# Altium schematic sheet RF.SchDoc: Air724UG 参考设计
size 594 x 419 mm; DESIGNER: Loukanghua; REV: V1.0
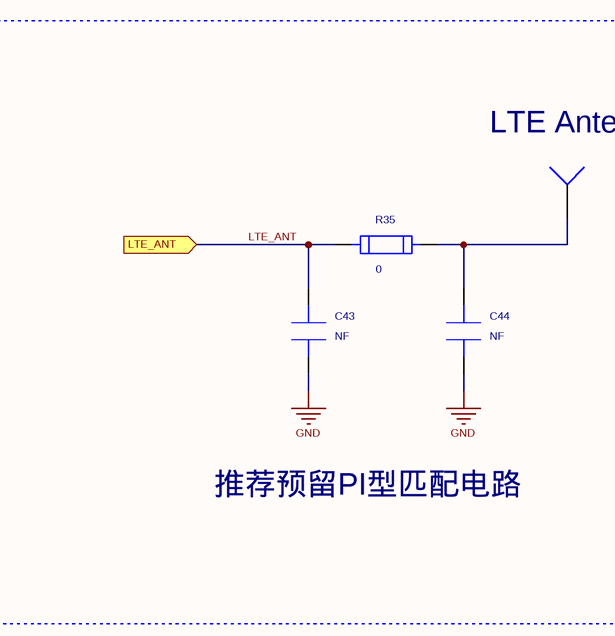
[diagram p0: RF.SchDoc, top left]
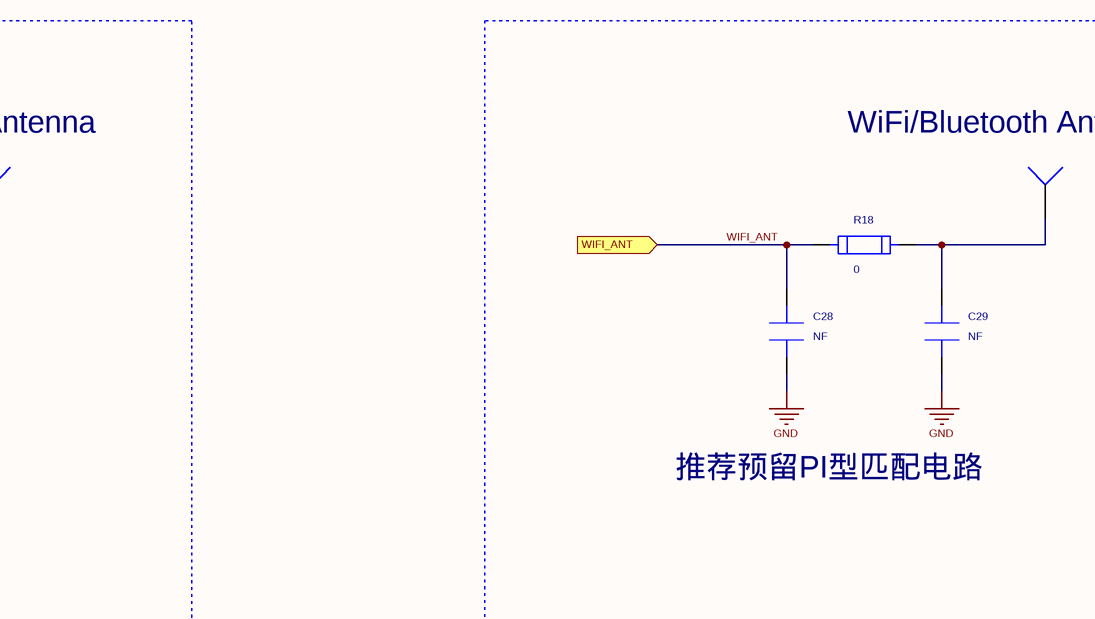
[diagram p1: RF.SchDoc, top middle]
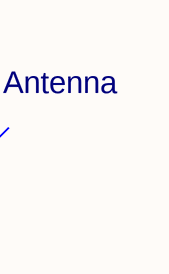
[diagram p2: RF.SchDoc, top right]
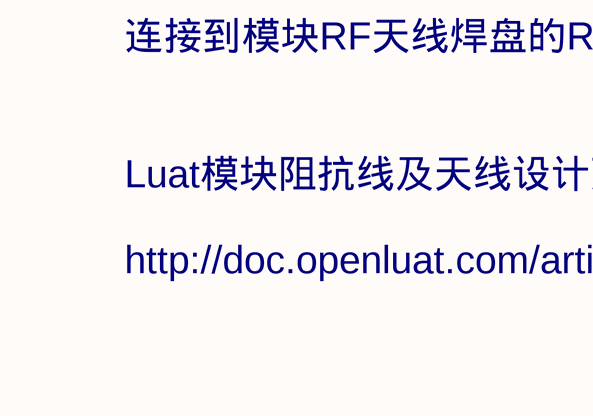
[diagram p3: RF.SchDoc, bottom left]
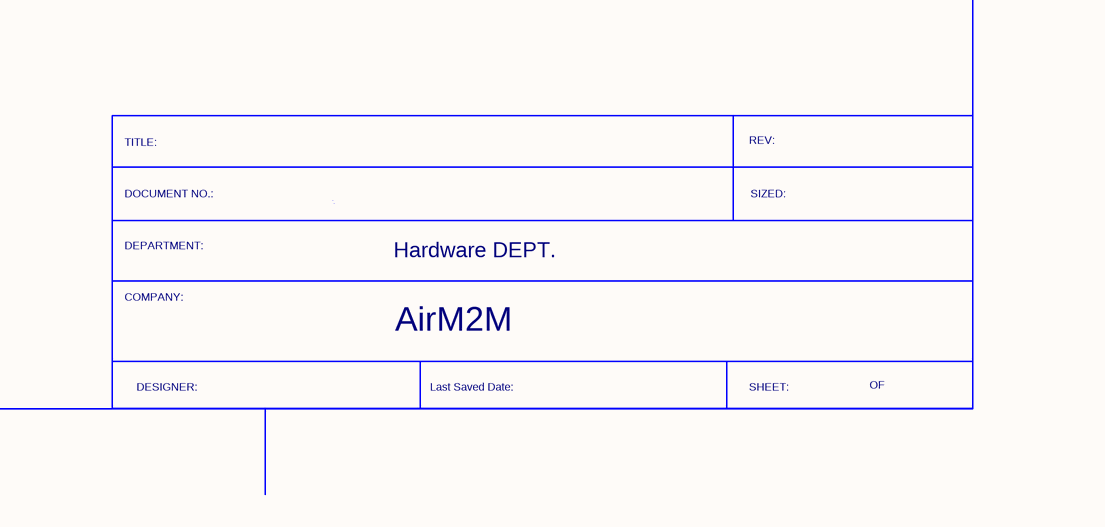
[diagram p4: RF.SchDoc, bottom right]

## Parts
C28  value NF  [SC0402-NF]  (hidden comment: CAP-0402-NF)
C29  value NF  [SC0402-NF]  (hidden comment: CAP-0402-NF)
C43  value NF  [SC0402-NF]  (hidden comment: CAP-0402-NF)
C44  value NF  [SC0402-NF]  (hidden comment: CAP-0402-NF)
J1  RF-ANT-P-JS-29-13  [RF-ANT-P-JS-29-13]  (value not drawn)
J6  RF-ANT-P-JS-29-13  [RF-ANT-P-JS-29-13]  (value not drawn)
R18  value 0  [SR0402]  (hidden comment: RES-0-0402)
R35  value 0  [SR0402]  (hidden comment: RES-0-0402)

## Ports
LTE_ANT, WIFI_ANT

## Nets
GND: C28.2 C29.2 C43.2 C44.2
LTE_ANT: C43.1 R35.1 ; port LTE_ANT
WIFI_ANT: C28.1 R18.1 ; port WIFI_ANT
NetC29_1: C29.1 J1.1 R18.2
NetC44_1: C44.1 J6.1 R35.2

## Notes on the sheet
- (near J6) LTE Antenna
- (near J1) WiFi/Bluetooth Antenna
- 推荐预留PI型匹配电路
- 连接到模块RF天线焊盘的RF走线必须使用微带线或者其他类型的 RF走线，阻抗必须控制在50欧姆左右。
- Luat模块阻抗线及天线设计建议_V1.0
- http://doc.openluat.com/article/2430/0
- TITLE:
- REV:
- DEPARTMENT:
- DOCUMENT NO.:
- Hardware DEPT.
- SIZED:
- COMPANY:
- AirM2M
- DESIGNER:
- Last Saved Date:
- SHEET:
- OF

## Library data of the parts
C28 C29 C43 C44 = CAP-0402-NF: NF; Geometry.Height: 0.55mm; Manufacture 1: NF; Manufacture 1 P/N: NF; Serial Number: NF; PCB DECAL: SC0402-NF
J1 J6 = RF-ANT-P-JS-29-13: 天线馈点连接器;1PIN;2.91*1.0*1.3mm;ROHS; Manufacture 1: 杰思;; serial number: 81300000178; Geometry.Height: 1.3mm; Manufacture 1 P/N: P-JS-29-13; Value: P-JS-29-13; PCB DECAL: RF-ANT-P-JS-29-13
R18 R35 = RES-0-0402: RES FILM;0;1A;0402;0.4mm;ROHS; Manufacture 1: YAGEO; Manufacture 1 P/N: RC0402JR-070RL; Serial Number: 80114640001; Geometry.Height: 0.4mm; PCB DECAL: SR0402